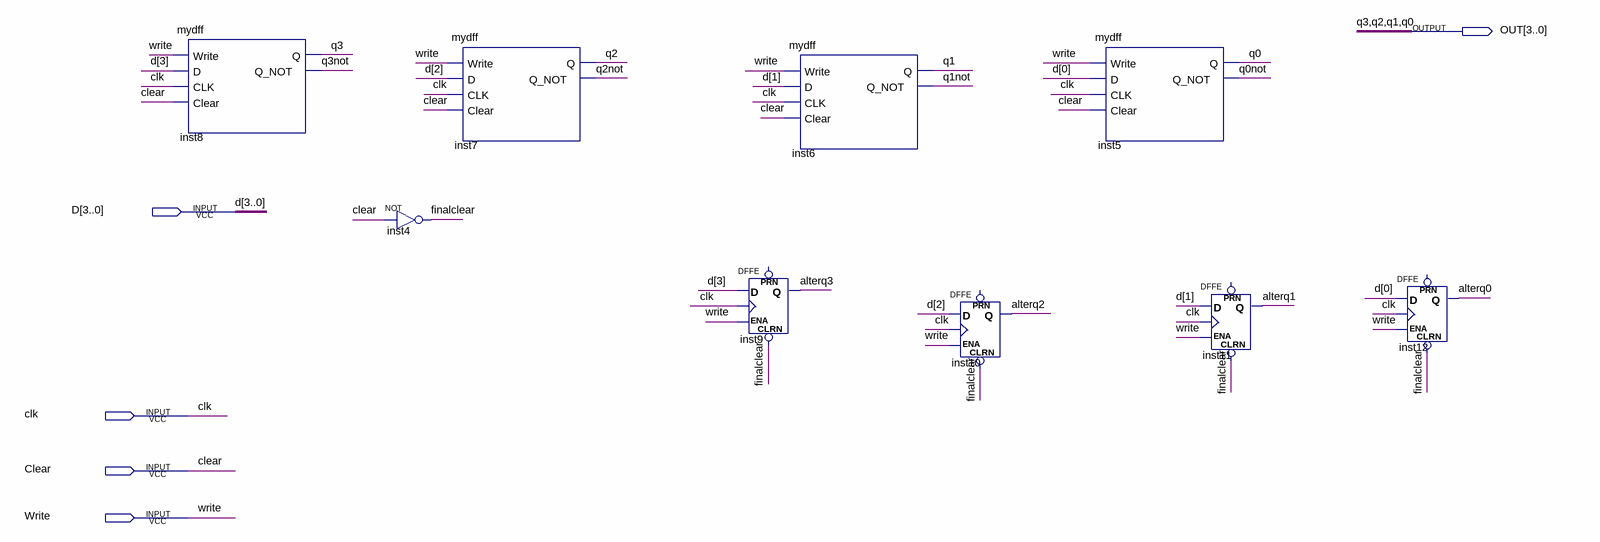
[diagram p0: schematic sheet]
// Quartus schematic register_4bit.bdf as structural Verilog: 9 symbols, 5 pins
module register_4bit (
  input  [3:0] D,
  input  clk,
  input  Clear,
  input  Write,
  output [3:0] OUT
);

  wire alterq0, alterq1, alterq2, alterq3, finalclear, q0not, q1not, q2not, q3not;

  mydff inst8 (.Write(Write), .D(D[3]), .CLK(clk), .Clear(Clear), .Q(OUT[3]), .Q_NOT(q3not));
  not inst4 (finalclear, Clear);
  mydff inst7 (.Write(Write), .D(D[2]), .CLK(clk), .Clear(Clear), .Q(OUT[2]), .Q_NOT(q2not));
  DFFE inst9 (.CLRN(finalclear), .D(D[3]), .CLK(clk), .ENA(Write), .Q(alterq3));  // open: PRN
  mydff inst6 (.Write(Write), .D(D[1]), .CLK(clk), .Clear(Clear), .Q(OUT[1]), .Q_NOT(q1not));
  DFFE inst10 (.CLRN(finalclear), .D(D[2]), .CLK(clk), .ENA(Write), .Q(alterq2));  // open: PRN
  mydff inst5 (.Write(Write), .D(D[0]), .CLK(clk), .Clear(Clear), .Q(OUT[0]), .Q_NOT(q0not));
  DFFE inst11 (.CLRN(finalclear), .D(D[1]), .CLK(clk), .ENA(Write), .Q(alterq1));  // open: PRN
  DFFE inst12 (.CLRN(finalclear), .D(D[0]), .CLK(clk), .ENA(Write), .Q(alterq0));  // open: PRN

  // Other names for the same wires on the sheet: q0 = OUT[0]; q1 = OUT[1]; q2 = OUT[2]; q3 = OUT[3]
endmodule
